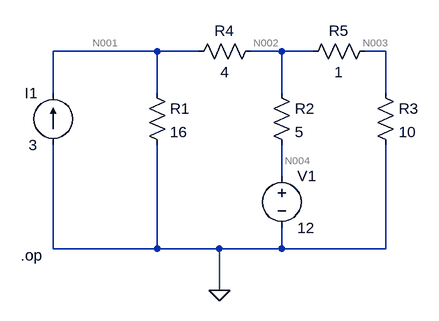
[diagram p0: schematic Draft1.asc]
Draft1.asc, the LTspice schematic file:
Version 4
SHEET 1 880 680
WIRE 128 -64 -32 -64
WIRE 192 -64 128 -64
WIRE 320 -64 272 -64
WIRE 368 -64 320 -64
WIRE 480 -64 448 -64
WIRE -32 0 -32 -64
WIRE 128 0 128 -64
WIRE 320 0 320 -64
WIRE 480 0 480 -64
WIRE 320 128 320 80
WIRE -32 240 -32 80
WIRE 128 240 128 80
WIRE 128 240 -32 240
WIRE 224 240 128 240
WIRE 320 240 320 208
WIRE 320 240 224 240
WIRE 480 240 480 80
WIRE 480 240 320 240
WIRE 224 304 224 240
FLAG 224 304 0
SYMBOL current -32 80 R180
WINDOW 0 24 80 Left 2
WINDOW 3 24 0 Left 2
SYMATTR InstName I1
SYMATTR Value 3
SYMBOL res 112 -16 R0
SYMATTR InstName R1
SYMATTR Value 16
SYMBOL res 304 -16 R0
SYMATTR InstName R2
SYMATTR Value 5
SYMBOL res 464 -16 R0
SYMATTR InstName R3
SYMATTR Value 10
SYMBOL res 288 -80 R90
WINDOW 0 0 56 VBottom 2
WINDOW 3 32 56 VTop 2
SYMATTR InstName R4
SYMATTR Value 4
SYMBOL res 464 -80 R90
WINDOW 0 0 56 VBottom 2
WINDOW 3 32 56 VTop 2
SYMATTR InstName R5
SYMATTR Value 1
SYMBOL voltage 320 112 R0
SYMATTR InstName V1
SYMATTR Value 12
TEXT -82 250 Left 2 !.op

The netlist it stands for:
* Draft1.asc
I1 0 N001 3
R1 N001 0 16
R2 N002 N004 5
R3 N003 0 10
R4 N002 N001 4
R5 N003 N002 1
V1 N004 0 12
.op
.backanno
.end

* Results of the author's LTspice run, read from the files saved beside the schematic
* Operating Point:
*   V(n001) = 20.86 V
*   V(n002) = 14.08 V
*   V(n004) = 12 V
*   V(n003) = 12.8 V
*   I(I1) = 3 A
*   I(R5) = -1.28 A
*   I(R4) = -1.696 A
*   I(R3) = 1.28 A
*   I(R2) = 416 mA
*   I(R1) = 1.304 A
*   I(V1) = 416 mA